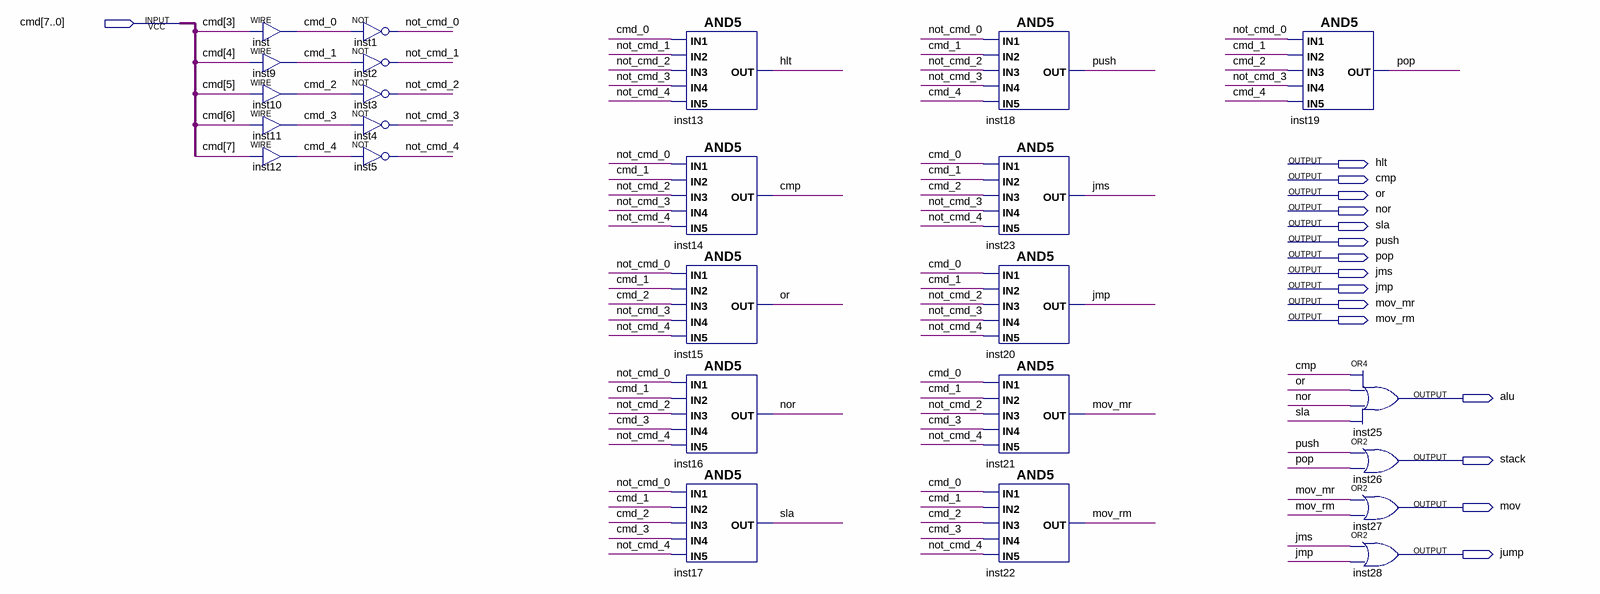
[diagram p0: schematic sheet]
// Quartus schematic command_decode.bdf as structural Verilog: 25 symbols, 16 pins
module command_decode (
  input  [7:0] cmd,
  output hlt,
  output cmp,
  output \or ,
  output \nor ,
  output sla,
  output push,
  output pop,
  output jms,
  output jmp,
  output mov_mr,
  output mov_rm,
  output alu,
  output stack,
  output mov,
  output jump
);

  wire cmd_0, cmd_1, cmd_2, cmd_3, cmd_4, not_cmd_0, not_cmd_1, not_cmd_2, not_cmd_3, not_cmd_4;

  assign cmd_0 = cmd[3];  // WIRE inst
  assign cmd_1 = cmd[4];  // WIRE inst9
  assign cmd_2 = cmd[5];  // WIRE inst10
  assign cmd_3 = cmd[6];  // WIRE inst11
  assign cmd_4 = cmd[7];  // WIRE inst12
  not inst1 (not_cmd_0, cmd_0);
  not inst2 (not_cmd_1, cmd_1);
  not inst3 (not_cmd_2, cmd_2);
  not inst4 (not_cmd_3, cmd_3);
  not inst5 (not_cmd_4, cmd_4);
  and inst13 (hlt, cmd_0, not_cmd_1, not_cmd_2, not_cmd_3, not_cmd_4);
  and inst14 (cmp, not_cmd_0, cmd_1, not_cmd_2, not_cmd_3, not_cmd_4);
  and inst15 (\or , not_cmd_0, cmd_1, cmd_2, not_cmd_3, not_cmd_4);
  and inst16 (\nor , not_cmd_0, cmd_1, not_cmd_2, cmd_3, not_cmd_4);
  and inst17 (sla, not_cmd_0, cmd_1, cmd_2, cmd_3, not_cmd_4);
  and inst18 (push, not_cmd_0, cmd_1, not_cmd_2, not_cmd_3, cmd_4);
  and inst23 (jms, cmd_0, cmd_1, cmd_2, not_cmd_3, not_cmd_4);
  and inst20 (jmp, cmd_0, cmd_1, not_cmd_2, not_cmd_3, not_cmd_4);
  and inst21 (mov_mr, cmd_0, cmd_1, not_cmd_2, cmd_3, not_cmd_4);
  and inst22 (mov_rm, cmd_0, cmd_1, cmd_2, cmd_3, not_cmd_4);
  and inst19 (pop, not_cmd_0, cmd_1, cmd_2, not_cmd_3, cmd_4);
  or inst25 (alu, cmp, \or , \nor , sla);
  or inst26 (stack, push, pop);
  or inst27 (mov, mov_mr, mov_rm);
  or inst28 (jump, jms, jmp);
endmodule
